# Altium schematic sheet JoyStick.SchDoc
size A4
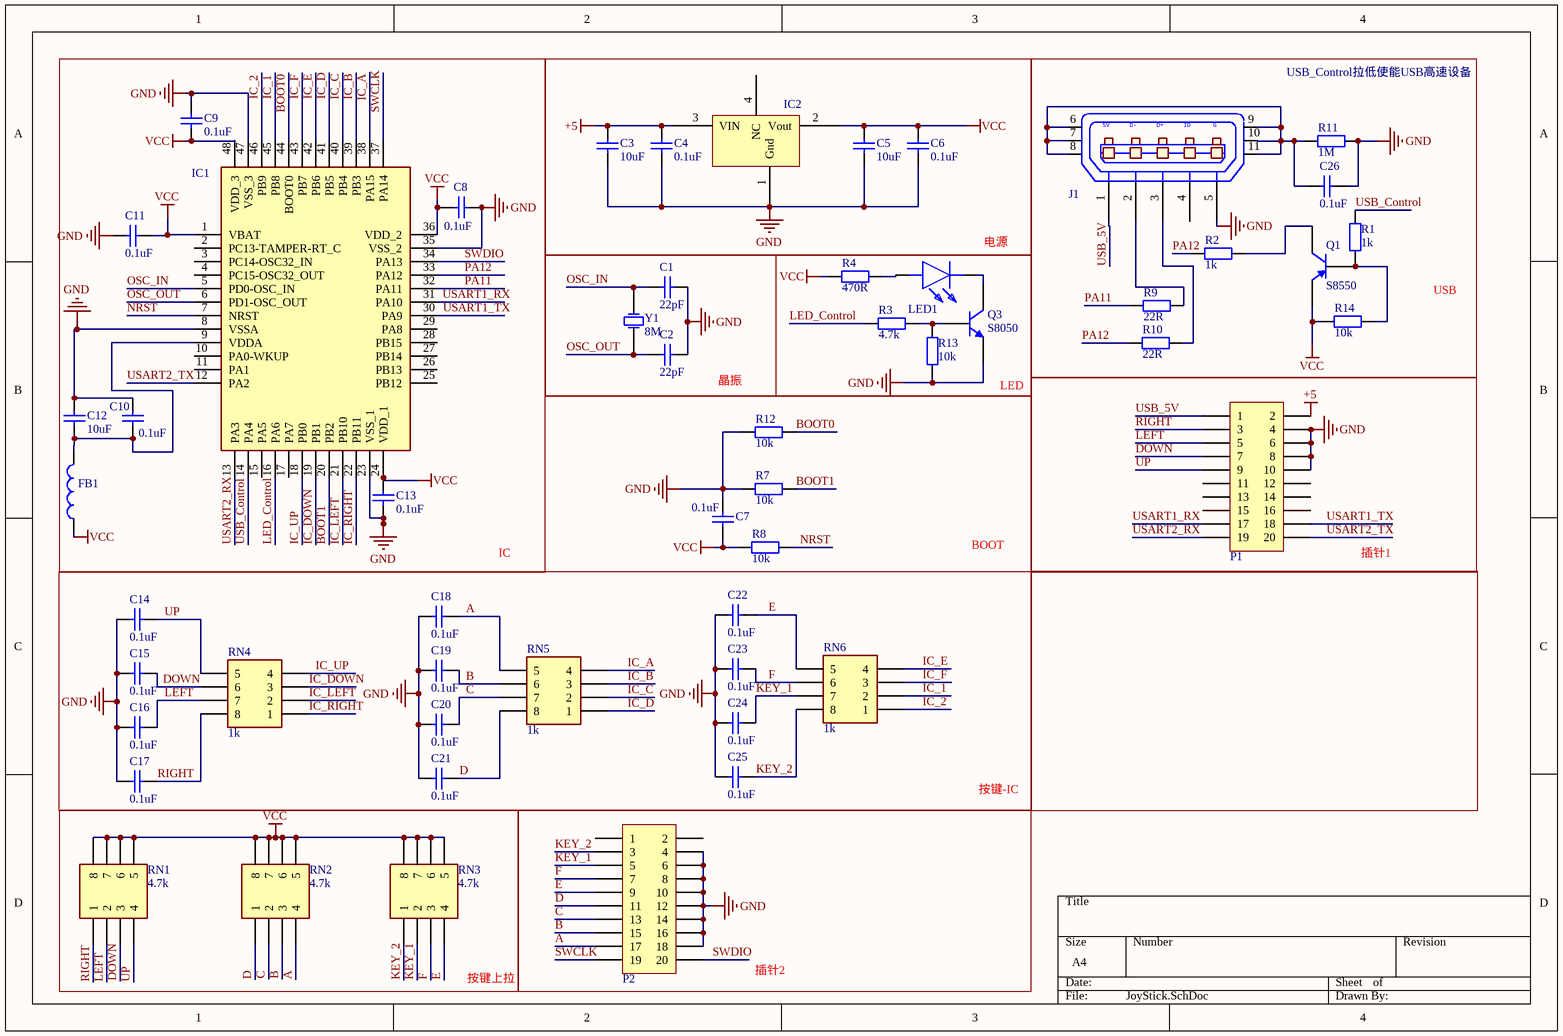
[diagram p0: JoyStick.SchDoc]

## Parts
C1  22pF  [CAP-0603]
C2  22pF  [CAP-0603]
C3  10uF  [CAP-1206]
C4  0.1uF  [CAP-0603]
C5  10uF  [CAP-1206]
C6  0.1uF  [CAP-0603]
C7  0.1uF  [CAP-0603]
C8  0.1uF  [CAP-0603]
C9  0.1uF  [CAP-0603]
C10  0.1uF  [CAP-0603]
C11  0.1uF  [CAP-0603]
C12  10uF  [CAP-1206]
C13  0.1uF  [CAP-0603]
C14  0.1uF  [CAP-0603]
C15  0.1uF  [CAP-0603]
C16  0.1uF  [CAP-0603]
C17  0.1uF  [CAP-0603]
C18  0.1uF  [CAP-0603]
C19  0.1uF  [CAP-0603]
C20  0.1uF  [CAP-0603]
C21  0.1uF  [CAP-0603]
C22  0.1uF  [CAP-0603]
C23  0.1uF  [CAP-0603]
C24  0.1uF  [CAP-0603]
C25  0.1uF  [CAP-0603]
C26  0.1uF  [CAP-0603]
FB1  Ferrite Bead  [Ferrite Bead-0603]  (value not drawn)
IC1  STM32F103C8T6  [LQFP48]  (value not drawn)
IC2  LM1117MPX-3.3  [SOT-223]  (value not drawn)
J1  Micro-USB  [Micro-USB]  (value not drawn)
LED1  LED  [LED-0603]  (value not drawn)
P1  Header 10x2  [Header 10x2]  (value not drawn)
P2  Header 10x2  [Header 10x2]  (value not drawn)
Q1  S8550  [SOT-23]
Q3  S8050  [SOT-23]
R1  1k  [Res-0603]
R2  1k  [Res-0603]
R3  4.7k  [Res-0603]
R4  470R  [Res-0603]
R7  10k  [Res-0603]
R8  10k  [Res-0603]
R9  22R  [Res-0603]
R10  22R  [Res-0603]
R11  1M  [Res-0603]
R12  10k  [Res-0603]
R13  10k  [Res-0603]
R14  10k  [Res-0603]
RN1  4.7k  [8P4R-0603]
RN2  4.7k  [8P4R-0603]
RN3  4.7k  [8P4R-0603]
RN4  1k  [8P4R-0603]
RN5  1k  [8P4R-0603]
RN6  1k  [8P4R-0603]
Y1  8M  [49-SMD]

## Blocks framed on the sheet
IC: C8-C13 FB1 IC1
电源: C3-C6 IC2
晶振: C1 C2 Y1
插针1: P1
按键-IC: C14-C25 RN4-RN6
按键上拉: RN1-RN3
插针2: P2

## Nets
 GND: C1.2 C2.2 C3.1 C4.1 C5.1 C6.1 C7.2 C8.1 C9.2 C10.2 C11.2 C12.2 C13.1 C14.2 C15.2 C16.2 C17.2 C18.2 C19.2 C20.2 C21.2 C22.2 C23.2 C24.2 C25.2 C26.1 IC1.8(VSSA) IC1.23(VSS_1) IC1.35(VSS_2) IC1.47(VSS_3) IC2.1(Gnd) J1.5(P5) P1.4 P1.6 P1.8 P1.10 P2.4 P2.6 P2.8 P2.10 P2.12 P2.14 P2.16 P2.18 Q3.2(E) R7.1 R11.2 R12.1 R13.2  [also labelled GND]
+5: C3.2 C4.2 IC2.3(VIN) P1.2
VCC: C5.2 C6.2 C7.1 C8.2 C9.1 C11.1 C13.2 FB1.1 IC1.1(VBAT) IC1.24(VDD_1) IC1.36(VDD_2) IC1.48(VDD_3) IC2.2(Vout) Q1.2(E) R4.1 R8.1 R14.2 RN1.5 RN1.6 RN1.7 RN1.8 RN2.5 RN2.6 RN2.7 RN2.8 RN3.5 RN3.6 RN3.7 RN3.8
A: C18.1 P2.17 RN2.4 RN5.5
B: C19.1 P2.15 RN2.3 RN5.6
BOOT0: IC1.44(BOOT0) R12.2
BOOT1: IC1.20(PB2) R7.2
C: C20.1 P2.13 RN2.2 RN5.7
D: C21.1 P2.11 RN2.1 RN5.8
DOWN: C15.1 P1.7 RN1.3 RN4.6
E: C22.1 P2.9 RN3.4 RN6.5
F: C23.1 P2.7 RN3.3 RN6.6
IC_1: IC1.45(PB8) RN6.2
IC_2: IC1.46(PB9) RN6.1
IC_A: IC1.38(PA15) RN5.4
IC_B: IC1.39(PB3) RN5.3
IC_C: IC1.40(PB4) RN5.2
IC_D: IC1.41(PB5) RN5.1
IC_DOWN: IC1.19(PB1) RN4.3
IC_E: IC1.42(PB6) RN6.4
IC_F: IC1.43(PB7) RN6.3
IC_LEFT: IC1.21(PB10) RN4.2
IC_RIGHT: IC1.22(PB11) RN4.1
IC_UP: IC1.18(PB0) RN4.4
KEY_1: C24.1 P2.5 RN3.2 RN6.7
KEY_2: C25.1 P2.3 RN3.1 RN6.8
LED_Control: IC1.16(PA6) R3.1
LEFT: C16.1 P1.5 RN1.2 RN4.7
NRST: IC1.7(NRST) R8.2
OSC_IN: C1.1 IC1.5(PD0-OSC_IN) Y1.2(OSC2)
OSC_OUT: C2.1 IC1.6(PD1-OSC_OUT) Y1.1(OSC1)
PA11: IC1.32(PA11) R9.1
PA12: IC1.33(PA12) R2.1 R10.1
RIGHT: C17.1 P1.3 RN1.1 RN4.8
SWCLK: IC1.37(PA14) P2.19
SWDIO: IC1.34(PA13) P2.20
UP: C14.1 P1.9 RN1.4 RN4.5
USART1_RX: IC1.31(PA10) P1.17
USART1_TX: IC1.30(PA9) P1.18
USART2_RX: IC1.13(PA3) P1.19
USART2_TX: IC1.12(PA2) P1.20
USB_5V: J1.1(P1) P1.1
USB_Control: IC1.14(PA4) R1.2
NetC10_1: C10.1 C12.1 FB1.2 IC1.9(VDDA)
NetC26_2: C26.2 J1.6(SHLD1) J1.7(SHLD2) J1.8(SHLD3) J1.9(SHLD4) J1.10(SHLD5) J1.11(SHLD6) R11.1
NetJ1_2: J1.2(P2) R9.2
NetJ1_3: J1.3(P3) R10.2
NetLED1_1: LED1.1(A) R4.2
NetLED1_2: LED1.2(K) Q3.3(C)
NetQ1_1: Q1.1(B) R1.1 R14.1
NetQ1_3: Q1.3(C) R2.2
NetQ3_1: Q3.1(B) R3.2 R13.1

Not connected (* = marked no-connect by the designer): IC1 2(PC13-TAMPER-RT_C) 3(PC14-OSC32_IN) 4(PC15-OSC32_OUT) 10(PA0-WKUP) 11(PA1) 15(PA5) 17(PA7) 25(PB12) 26(PB13) 27(PB14) 28(PB15) 29(PA8); IC2 4(NC); J1 4(P4); P1 11 12 13 14 15 16; P2 1 2

## Notes on the sheet
- USB_Control拉低使能USB高速设备
- USB
- LED
- BOOT
- (in symbol Micro-USB) 5V; D-; D+; ID; G

## Library data of the parts
C1 C2 C4 C6-C11 C13-C26 = Cap-0603: Capacitance
C3 C5 C12 = Cap-1206: Capacitance
IC1 = STM32F103C8T6: Integrated Circuit; Manufacturer_Name: STMicroelectronics; Manufacturer_Part_Number: STM32F103C8T6TR; Datasheet Link: http://media.digikey.com/pdf/Data%20Sheets/ST%20Microelectronics%20PDFS/STM32F103x8,B.pdf; Height: 1.6mm; Arrow Part Number: STM32F103C8T6TR; Arrow Price/Stock: https://www.arrow.com/en/products/stm32f103c8t6tr/stmicroelectronics; Mouser Part Number: 511-STM32F103C8T6TR; Mouser Price/Stock: https://www.mouser.co.uk/ProductDetail/STMicroelectronics/STM32F103C8T6TR?qs=5HwTSiuA5HDxFj62n06yag%3D%3D
IC2 = LM1117MPX-3.3: Integrated Circuit; Manufacturer_Name: Texas Instruments; Manufacturer_Part_Number: LM1117IMPX3.3/NOPB; Datasheet Link: http://www.ti.com/lit/ds/symlink/lm1117.pdf; Height: 1.8mm
J1 = Micro-USB: Connector; Manufacturer_Name: Amphenol; Manufacturer_Part_Number: 10103593-0001LF; Datasheet Link: https://cdn.amphenol-icc.com/media/wysiwyg/files/drawing/10103593.pdf; Height: 2mm; Arrow Part Number: 10103593-0001LF; Arrow Price/Stock: https://www.arrow.com/en/products/10103593-0001lf/amphenol-fci; Mouser Part Number: 649-10103593-0001LF; Mouser Price/Stock: https://www.mouser.co.uk/ProductDetail/Amphenol-FCI/10103593-0001LF?qs=EnLMdcWnKAAYkpXwqGEfpw%3D%3D
LED1 = LED: Manufacturer_Name: Wurth Elektronik; Manufacturer_Part_Number: 150060SS75020; Datasheet Link: https://componentsearchengine.com/Datasheets/2/150060SS75020.pdf; Height: 0.45mm; Mouser Part Number: 710-150060SS75020; Mouser Price/Stock: https://www.mouser.co.uk/ProductDetail/Wurth-Elektronik/150060SS75020?qs=d0WKAl%252BL4KYahr%2FibUhgAg%3D%3D
Q1 = S8550: PNP; Manufacturer_Name: Galaxy; Manufacturer_Part_Number: S8050G; Datasheet Link: http://www.gmesemi.com/KUpload/product/TR/S8050%20SOT-23.pdf; Height: 1.1mm
Q3 = S8050: NPN
R1-R4 R7-R14 = Res-0603: Resistor
RN1-RN6 = 8P4R-0603: Resistor Network; Manufacturer_Name: Panasonic; Manufacturer_Part_Number: EXB-U38512JV; Datasheet Link: https://componentsearchengine.com/Datasheets/1/EXB-U38512JV.pdf; Height: 0.6mm; Mouser Part Number: 667-EXB-U38512JV; Mouser Price/Stock: https://www.mouser.com/Search/Refine.aspx?Keyword=667-EXB-U38512JV
Y1 = XTAL: Crystal Oscillator; Manufacturer_Name: ZHUHAI MONEC ELEC; Manufacturer_Part_Number: ESB16.0000F12M25F; Datasheet Link: https://datasheet.lcsc.com/szlcsc/1901101104_ZHUHAI-MONEC-ELEC-ESB16-0000F12M25F_C353715.pdf; Height: 4.2mm